# EAGLE design nixie (EAGLE 5.11)
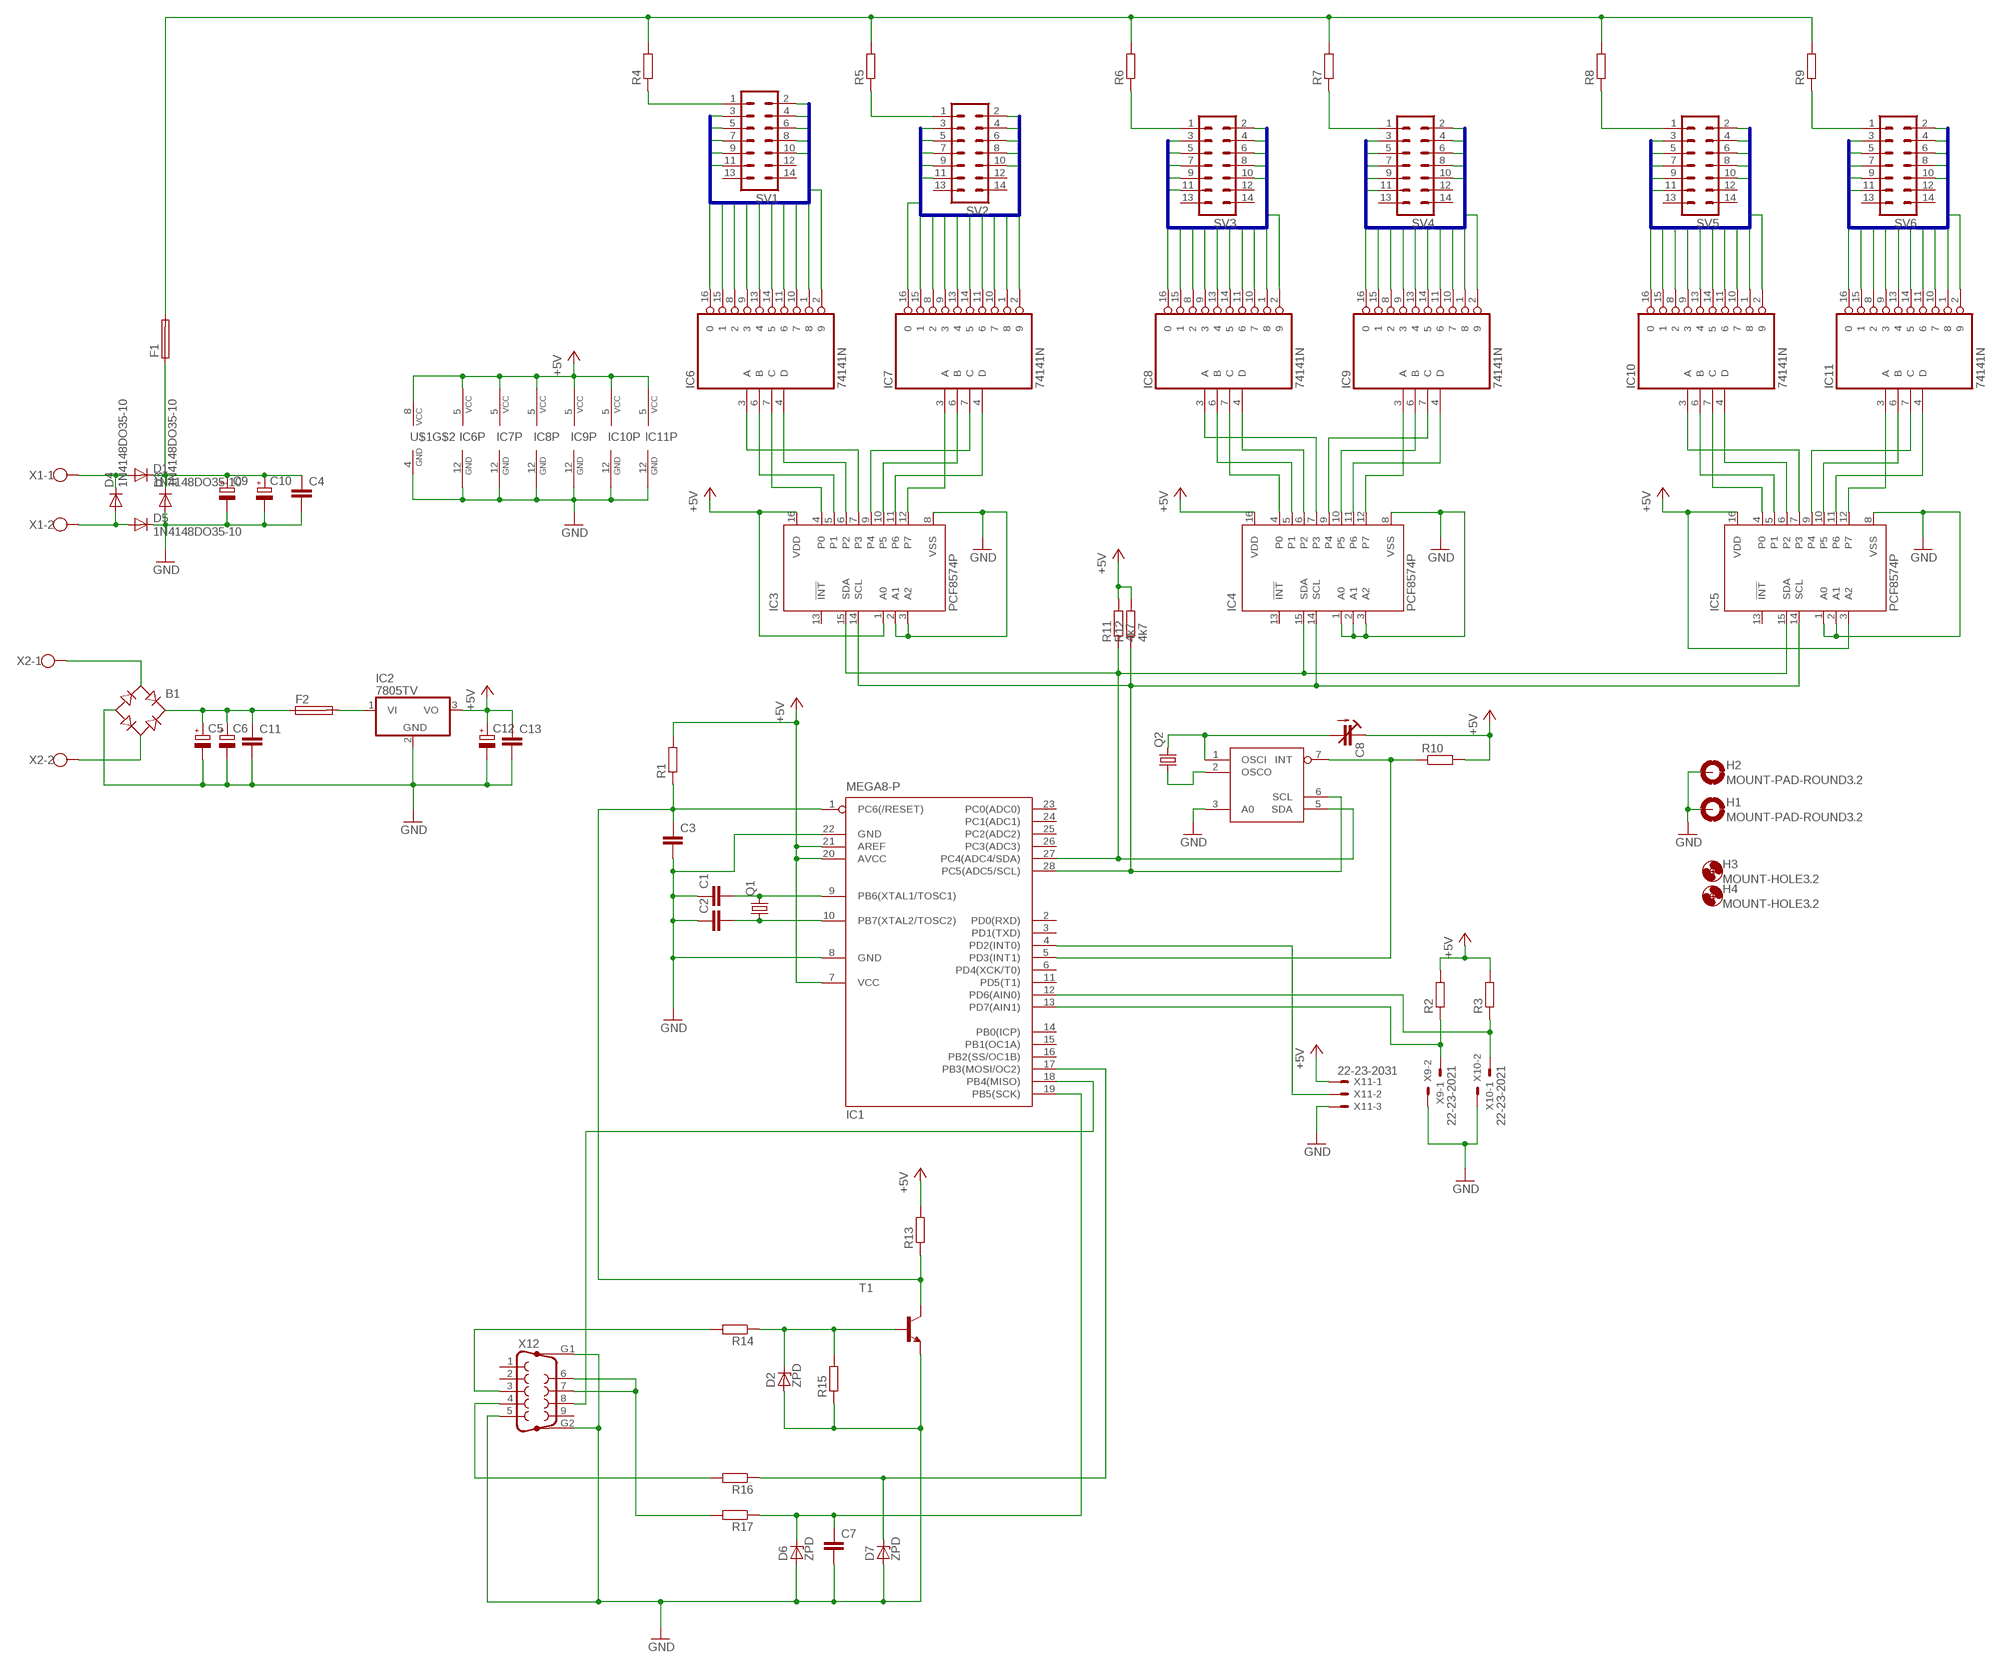
[diagram p0: schematic, sheet 1]

## Parts
B1  RB1A  [RB1A]
C1  C-EU025-025X050  [C025-025X050]
C2  C-EU025-025X050  [C025-025X050]
C3  C-EU025-025X050  [C025-025X050]
C4  C-EU150-054X183  [C150-054X183]
C5  CPOL-EUE5-10.5  [E5-10,5]
C6  CPOL-EUE5-10.5  [E5-10,5]
C7  C-EU050-024X044  [C050-024X044]
C8  C-TRIMM808  [CTRIM808-BC]
C9  CPOL-EUE7.5-18  [E7,5-18]
C10  CPOL-EUE7.5-18  [E7,5-18]
C11  C-EU050-025X075  [C050-025X075]
C12  CPOL-EUE2.5-7  [E2,5-7]
C13  C-EU050-025X075  [C050-025X075]
D1  1N4148DO35-10  [DO35-10]
D2  ZPD  [DO35Z10]
D3  1N4148DO35-10  [DO35-10]
D4  1N4148DO35-10  [DO35-10]
D5  1N4148DO35-10  [DO35-10]
D6  ZPD  [DO35Z10]
D7  ZPD  [DO35Z10]
F1  SH25  [SH25]
F2  SH25  [SH25]
H1  MOUNT-PAD-ROUND3.2  [3,2-PAD]
H2  MOUNT-PAD-ROUND3.2  [3,2-PAD]
H3  MOUNT-HOLE3.2  [3,2]
H4  MOUNT-HOLE3.2  [3,2]
IC1  MEGA8-P  [DIL28-3]
IC2  7805TV  [TO220V]
IC3  PCF8574P  [DIL16]
IC4  PCF8574P  [DIL16]
IC5  PCF8574P  [DIL16]
IC6  74141N  [DIL16]
IC7  74141N  [DIL16]
IC8  74141N  [DIL16]
IC9  74141N  [DIL16]
IC10  74141N  [DIL16]
IC11  74141N  [DIL16]
Q1  CRYSTALHC49S  [HC49/S]
Q2  CRYSTALTC26V  [TC26V]
R1  R-EU_0207/10  [0207/10]
R2  R-EU_0207/10  [0207/10]
R3  R-EU_0207/10  [0207/10]
R4  R-EU_0207/10  [0207/10]
R5  R-EU_0207/10  [0207/10]
R6  R-EU_0207/10  [0207/10]
R7  R-EU_0207/10  [0207/10]
R8  R-EU_0207/10  [0207/10]
R9  R-EU_0207/10  [0207/10]
R10  R-EU_0207/10  [0207/10]
R11  4k7  R-EU_0207/10  [0207/10]
R12  4k7  R-EU_0207/10  [0207/10]
R13  R-EU_0207/10  [0207/10]
R14  R-EU_0207/10  [0207/10]
R15  R-EU_0207/10  [0207/10]
R16  R-EU_0207/10  [0207/10]
R17  R-EU_0207/10  [0207/10]
SV1  ML14  [ML14]
SV2  ML14  [ML14]
SV3  ML14  [ML14]
SV4  ML14  [ML14]
SV5  ML14  [ML14]
SV6  ML14  [ML14]
T1  BC547B-NPN-TO92-CBE  [TO92-CBE]
U$1  PCF8583P  [DIL08]
X1  W237-102  [W237-102]
X2  W237-102  [W237-102]
X9  22-23-2021  [22-23-2021]
X10  22-23-2021  [22-23-2021]
X11  22-23-2031  [22-23-2031]
X12  F09HP  [F09HP]

## Nets
+5V: C8.1(E) C12.+ C13.1 IC1.7(VCC) IC1.20(AVCC) IC1.21(AREF) IC2.3(VO) IC3.1(A0) IC3.16(VDD) IC4.16(VDD) IC5.3(A2) IC5.16(VDD) IC6.5(VCC) IC7.5(VCC) IC8.5(VCC) IC9.5(VCC) IC10.5(VCC) IC11.5(VCC) R1.2 R2.2 R3.2 R10.2 R11.2 R12.2 R13.2 U$1.8(VCC) X11.1
GND: B1.- C1.1 C2.1 C3.2 C4.2 C5.- C6.- C7.2 C9.- C10.- C11.2 C12.- C13.2 D2.A D3.A D5.C D6.A D7.A H1.B3,2(MOUNT) H2.B3,2(MOUNT) IC1.8(GND) IC1.22(GND) IC2.2(GND) IC3.2(A1) IC3.3(A2) IC3.8(VSS) IC4.1(A0) IC4.2(A1) IC4.3(A2) IC4.8(VSS) IC5.1(A0) IC5.2(A1) IC5.8(VSS) IC6.12(GND) IC7.12(GND) IC8.12(GND) IC9.12(GND) IC10.12(GND) IC11.12(GND) R15.1 T1.E U$1.3(A0) U$1.4(GND) X9.2 X10.2 X11.3 X12.5 X12.G1 X12.G2
N1_0: IC6.16 SV1.4
N1_1: IC6.15 SV1.5
N1_2: IC6.8 SV1.11
N1_3: IC6.9 SV1.10
N1_4: IC6.13 SV1.7
N1_5: IC6.14 SV1.6
N1_6: IC6.11 SV1.8
N1_7: IC6.10 SV1.9
N1_8: IC6.1 SV1.2
N1_9: IC6.2 SV1.3
N2_0: IC7.16 SV2.4
N2_1: IC7.15 SV2.5
N2_2: IC7.8 SV2.11
N2_3: IC7.9 SV2.10
N2_4: IC7.13 SV2.7
N2_5: IC7.14 SV2.6
N2_6: IC7.11 SV2.8
N2_7: IC7.10 SV2.9
N2_8: IC7.1 SV2.2
N2_9: IC7.2 SV2.3
N3_0: IC8.16 SV3.4
N3_1: IC8.15 SV3.5
N3_2: IC8.8 SV3.11
N3_3: IC8.9 SV3.10
N3_4: IC8.13 SV3.7
N3_5: IC8.14 SV3.6
N3_6: IC8.11 SV3.8
N3_7: IC8.10 SV3.9
N3_8: IC8.1 SV3.2
N3_9: IC8.2 SV3.3
N4_0: IC9.16 SV4.4
N4_1: IC9.15 SV4.5
N4_2: IC9.8 SV4.11
N4_3: IC9.9 SV4.10
N4_4: IC9.13 SV4.7
N4_5: IC9.14 SV4.6
N4_6: IC9.11 SV4.8
N4_7: IC9.10 SV4.9
N4_8: IC9.1 SV4.2
N4_9: IC9.2 SV4.3
N5_0: IC10.16 SV5.4
N5_1: IC10.15 SV5.5
N5_2: IC10.8 SV5.11
N5_3: IC10.9 SV5.10
N5_4: IC10.13 SV5.7
N5_5: IC10.14 SV5.6
N5_6: IC10.11 SV5.8
N5_7: IC10.10 SV5.9
N5_8: IC10.1 SV5.2
N5_9: IC10.2 SV5.3
N6_0: IC11.16 SV6.4
N6_1: IC11.15 SV6.5
N6_2: IC11.8 SV6.11
N6_3: IC11.9 SV6.10
N6_4: IC11.13 SV6.7
N6_5: IC11.14 SV6.6
N6_6: IC11.11 SV6.8
N6_7: IC11.10 SV6.9
N6_8: IC11.1 SV6.2
N6_9: IC11.2 SV6.3
N$1: C1.2 IC1.9(PB6(XTAL1/TOSC1)) Q1.2
N$2: C2.2 IC1.10(PB7(XTAL2/TOSC2)) Q1.1
N$3: IC3.9(P4) IC7.7(C)
N$4: IC3.10(P5) IC7.6(B)
N$5: IC3.11(P6) IC7.4(D)
N$6: IC3.12(P7) IC7.3(A)
N$7: IC3.4(P0) IC6.7(C)
N$8: IC3.5(P1) IC6.6(B)
N$9: IC3.6(P2) IC6.4(D)
N$10: IC3.7(P3) IC6.3(A)
N$11: IC4.4(P0) IC8.7(C)
N$12: IC4.5(P1) IC8.6(B)
N$13: IC4.6(P2) IC8.4(D)
N$14: IC4.7(P3) IC8.3(A)
N$15: IC4.9(P4) IC9.7(C)
N$16: IC4.10(P5) IC9.6(B)
N$17: R6.1 SV3.1
N$18: IC5.10(P5) IC11.6(B)
N$19: IC5.4(P0) IC10.7(C)
N$20: IC5.5(P1) IC10.6(B)
N$21: IC5.6(P2) IC10.4(D)
N$22: IC5.7(P3) IC10.3(A)
N$23: IC5.9(P4) IC11.7(C)
N$24: R4.1 SV1.1
N$25: R5.1 SV2.1
N$26: R7.1 SV4.1
N$27: IC1.27(PC4(ADC4/SDA)) IC3.15(SDA) IC4.15(SDA) IC5.15(SDA) R11.1 U$1.5(SDA)
N$28: IC1.28(PC5(ADC5/SCL)) IC3.14(SCL) IC4.14(SCL) IC5.14(SCL) R12.1 U$1.6(SCL)
N$29: R8.1 SV5.1
N$30: IC1.13(PD7(AIN1)) R2.1 X9.1
N$31: IC1.12(PD6(AIN0)) R3.1 X10.1
N$32: F1.2 R4.2 R5.2 R6.2 R7.2 R8.2 R9.2
N$33: B1.AC1 X2.1
N$34: D4.A D5.A X1.2
N$35: D1.A D4.C X1.1
N$36: B1.AC2 X2.2
N$37: R9.1 SV6.1
N$38: B1.+ C5.+ C6.+ C11.1 F2.1
N$39: C4.1 C9.+ C10.+ D1.C D3.C F1.1
N$40: F2.2 IC2.1(VI)
N$64: IC5.11(P6) IC11.4(D)
N$65: IC5.12(P7) IC11.3(A)
N$66: IC4.11(P6) IC9.4(D)
N$67: IC4.12(P7) IC9.3(A)
N$104: IC1.5(PD3(INT1)) R10.1 U$1.7(INT)
N$105: IC1.4(PD2(INT0)) X11.2
N$106: C3.1 IC1.1(PC6(/RESET)) R1.1 R13.1 T1.C
N$107: Q2.1 U$1.2(OSCO)
N$108: C8.2(A) Q2.2 U$1.1(OSCI)
N$110: D2.C R14.1 R15.2 T1.B
N$112: R14.2 X12.3
N$113: IC1.18(PB4(MISO)) X12.8
N$114: R16.2 X12.4
N$115: D7.C IC1.17(PB3(MOSI/OC2)) R16.1
N$116: R17.2 X12.6 X12.7
N$117: C7.1 D6.C IC1.19(PB5(SCK)) R17.1
Unconnected: IC1.2(PD0(RXD)) IC1.3(PD1(TXD)) IC1.6(PD4(XCK/T0)) IC1.11(PD5(T1)) IC1.14(PB0(ICP)) IC1.15(PB1(OC1A)) IC1.16(PB2(SS/OC1B)) IC1.23(PC0(ADC0)) IC1.24(PC1(ADC1)) IC1.25(PC2(ADC2)) IC1.26(PC3(ADC3)) IC3.13(!INT) IC4.13(!INT) IC5.13(!INT) SV1.12 SV1.13 SV1.14 SV2.12 SV2.13 SV2.14 SV3.12 SV3.13 SV3.14 SV4.12 SV4.13 SV4.14 SV5.12 SV5.13 SV5.14 SV6.12 SV6.13 SV6.14 X12.1 X12.2 X12.9

## Buses
B$1
B$2
B$3
B$4
B$5
B$6

## Library data of the parts
B1 = rectifier:RB1A: RECTIFIER 1 A
C1-C4 C7 C11 C13 = rcl:C-EU: CAPACITOR, European symbol
C5 C6 C9 C10 C12 = rcl:CPOL-EU: POLARIZED CAPACITOR, European symbol
C8 = rcl:C-TRIMM: Trimm capacitor
D1 D3-D5 = diode:1N4148: DIODE high speed (Philips)
D2 D6 D7 = diode:ZPD: Z DIODE 500 mW
F1 F2 = fuse:SH25: FUSE HOLDER grid 25 mm, OGN0031 8211, Schurter (Buerklin); MF: SCHURTER; MPN: 0031.8211; OC_FARNELL: 1162741; OC_NEWARK: 96B9380
H1 H2 = holes:MOUNT-PAD-ROUND: MOUNTING PAD, round
H3 H4 = holes:MOUNT-HOLE: MOUNTING HOLE with drill center marker
IC1 = atmel:MEGA8-P: MICROCONTROLLER 8 Kbytes FLASH, 1 kbytes SRAM, 512 bytes EEPROM, USART, 4-channel 10 bit ADC, 2-channel 8 bit ADC Pin compatible with Atmega48, ATMega88, ATMega168 Source: avr.lbr
IC2 = linear:78*: Positive VOLTAGE REGULATOR Source: http://cache.national.com/ds/LM/LM78L05.pdf http://www.fairchildsemi.com/ds/LM/LM7805.pdf
IC3-IC5 = micro-philips:PCF8574: I2C-Bus Remote 8-bit I/O expander http://www.semiconductors.philips.com/acrobat_download/datasheets/PCF8574_4.pdf
IC6-IC11 = 74xx-us:74*141: BCD to decimal DECODER/DRIVER
Q1 = crystal:CRYSTAL: CRYSTAL; OC_FARNELL: 1667008; OC_NEWARK: unknown
Q2 = crystal:CRYSTAL: CRYSTAL; OC_FARNELL: unknown; OC_NEWARK: unknown
R1-R17 = rcl:R-EU_: RESISTOR, European symbol
SV1-SV6 = con-harting-ml:ML14: HARTING; OC_FARNELL: unknown; OC_NEWARK: unknown
T1 = transistor:*-NPN-: NPN Transistror BF959 corrected 2008.03.06
U$1 = i2c:PCF8583: Clock/calendar with 240 x 8-bit RAM
X1 X2 = con-wago-500:W237-102: WAGO SCREW CLAMP
X9 X10 = con-molex:22-23-2021: .100" (2.54mm) Center Header - 2 Pin
X11 = con-molex:22-23-2031: .100" (2.54mm) Center Header - 3 Pin
X12 = con-subd:F09HP: SUB-D; OC_FARNELL: unknown; OC_NEWARK: unknown

## Board
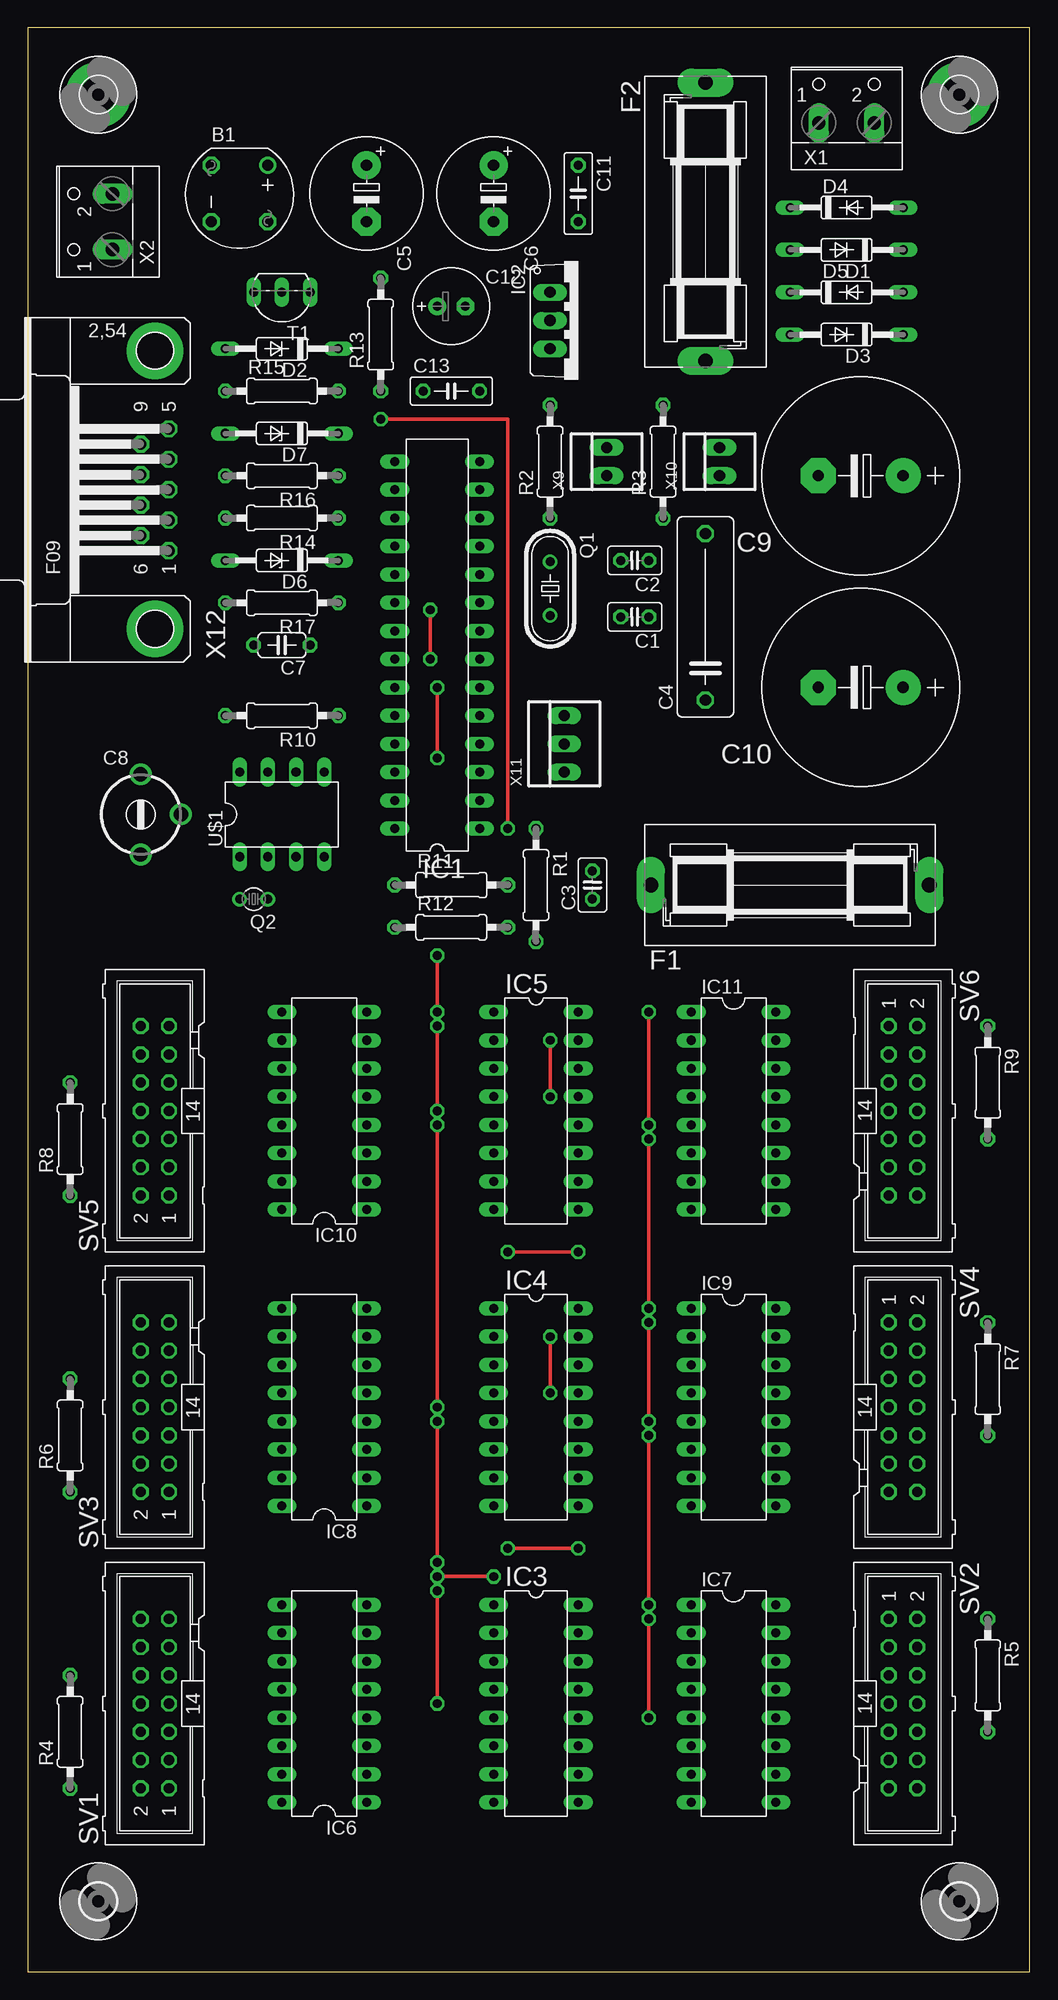
[diagram p1: board, top side]
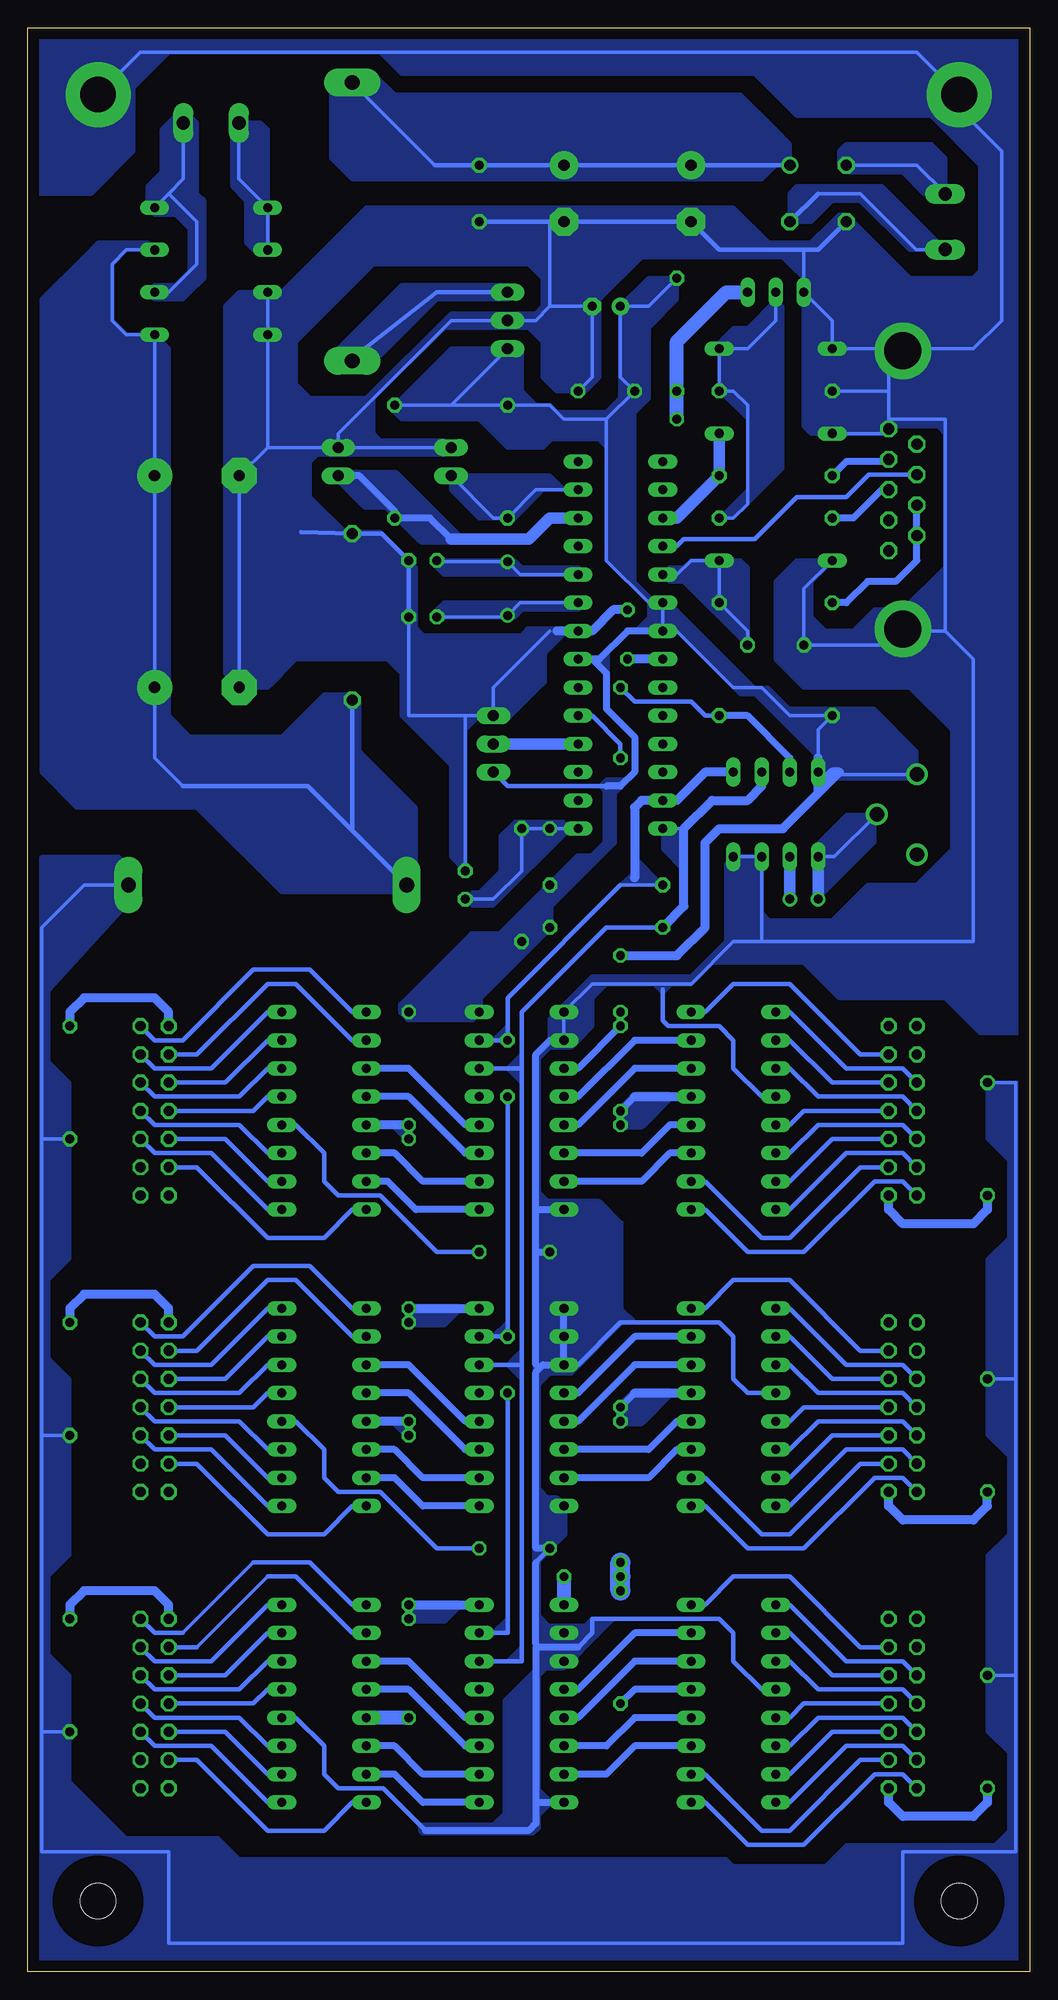
[diagram p2: board, bottom side, seen from below]

Size 90.15 x 174.93 mm. Coordinates in mm from the lower left corner, seen from the top.
Outline: 0,0 90.15,0 90.15,174.93 0,174.93 0,0
Copper layers (1*16): Top 0.035mm / dielectric 1.5mm / Bottom 0.035mm
Design rules "default": minimum track width 10mil, minimum drill 24mil, track to track 8mil, track to pad 8mil, pad to pad 8mil, via to via 8mil, smd to smd 8mil, copper to edge 40mil, drill to drill 8mil, minimum pad ring 10mil, minimum via ring 8mil, stop-mask expansion 4mil, vias tented up to drill 0mil, thermal gap 10mil

### Footprints (pad centres in the part's own frame; a part is rotated, then mirrored left to right if it is on the bottom)
RB1A = drill 1.016 round: + -2.54,2.54 | drill 1.016 octagon: - 2.54,-2.54; AC1 2.54,2.54; AC2 -2.54,-2.54
C025-025X050 = drill 0.813 octagon: 1 -1.27,0; 2 1.27,0
C150-054X183 = drill 1.016 octagon: 1 -7.493,0; 2 7.493,0
E5-10,5 = drill 1.016 pad 2.54 round: + -2.54,0 | drill 1.016 pad 2.54 octagon: - 2.54,0
C050-024X044 = drill 0.813 octagon: 1 -2.54,0; 2 2.54,0
CTRIM808-BC = drill 1.3 round: 1 -3.607,0; 2 0,3.607; 3 3.607,0
E7,5-18 = drill 1.016 pad 3.15 round: + -3.81,0 | drill 1.016 pad 3.15 octagon: - 3.81,0
C050-025X075 = drill 0.813 octagon: 1 -2.54,0; 2 2.54,0
E2,5-7 = drill 0.813 pad 1.6 round: + -1.27,0 | drill 0.813 pad 1.6 octagon: - 1.27,0
DO35-10 = drill 0.813 long: A 5.08,0; C -5.08,0
DO35Z10 = drill 0.813 long: A 5.08,0; C -5.08,0
SH25 = drill 1.321 pad 2.54 long: 1 -12.522,0; 2 12.522,0
3,2-PAD = drill 3.2 pad 5.842 round: B3,2 0,0
3,2 = hole 3.2: 0,0
DIL28-3 = drill 0.813 long: 1 -16.51,-3.81; 2 -13.97,-3.81; 3 -11.43,-3.81; 4 -8.89,-3.81; 5 -6.35,-3.81; 6 -3.81,-3.81; 7 -1.27,-3.81; 8 1.27,-3.81; 9 3.81,-3.81; 10 6.35,-3.81; 11 8.89,-3.81; 12 11.43,-3.81; 13 13.97,-3.81; 14 16.51,-3.81; 15 16.51,3.81; 16 13.97,3.81; 17 11.43,3.81; 18 8.89,3.81; 19 6.35,3.81; 20 3.81,3.81; 21 1.27,3.81; 22 -1.27,3.81; 23 -3.81,3.81; 24 -6.35,3.81; 25 -8.89,3.81; 26 -11.43,3.81; 27 -13.97,3.81; 28 -16.51,3.81
TO220V = drill 1.016 long: 1 -2.54,-2.54; 2 0,-2.54; 3 2.54,-2.54
DIL16 = drill 0.813 long: 1 -8.89,-3.81; 2 -6.35,-3.81; 3 -3.81,-3.81; 4 -1.27,-3.81; 5 1.27,-3.81; 6 3.81,-3.81; 7 6.35,-3.81; 8 8.89,-3.81; 9 8.89,3.81; 10 6.35,3.81; 11 3.81,3.81; 12 1.27,3.81; 13 -1.27,3.81; 14 -3.81,3.81; 15 -6.35,3.81; 16 -8.89,3.81
HC49/S = drill 0.813 round: 1 -2.413,0; 2 2.413,0
TC26V = drill 0.813 round: 1 -1.27,0; 2 1.27,0
0207/10 = drill 0.813 octagon: 1 -5.08,0; 2 5.08,0
ML14 = drill 0.914 octagon: 1 -7.62,-1.27; 2 -7.62,1.27; 3 -5.08,-1.27; 4 -5.08,1.27; 5 -2.54,-1.27; 6 -2.54,1.27; 7 0,-1.27; 8 0,1.27; 9 2.54,-1.27; 10 2.54,1.27; 11 5.08,-1.27; 12 5.08,1.27; 13 7.62,-1.27; 14 7.62,1.27
TO92-CBE = drill 0.813 long: B 0,0; C -2.54,0; E 2.54,0
DIL08 = drill 0.813 long: 1 -3.81,-3.81; 2 -1.27,-3.81; 3 1.27,-3.81; 4 3.81,-3.81; 5 3.81,3.81; 6 1.27,3.81; 7 -1.27,3.81; 8 -3.81,3.81
W237-102 = drill 1.194 long: 1 -2.5,-1.27; 2 2.5,-1.27
22-23-2021 = drill 1 long: 1 -1.27,0; 2 1.27,0
22-23-2031 = drill 1 long: 1 -2.54,0; 2 0,0; 3 2.54,0
F09HP = drill 1.016 octagon: 1 -5.486,-1.27; 2 -2.743,-1.27; 3 0,-1.27; 4 2.743,-1.27; 5 5.486,-1.27; 6 -4.115,1.27; 7 -1.372,1.27; 8 1.372,1.27; 9 4.115,1.27 | drill 3.302 pad 5.08 round: G1 -12.522,0; G2 12.522,0

### Placement (x,y rotation side)
B1  19.05,160.02 270 top
C1  54.61,121.92 180 top
C2  54.61,127 180 top
C3  50.8,97.79 90 top
C4  60.96,121.92 90 top
C5  30.48,160.02 270 top
C6  41.91,160.02 270 top
C7  22.86,119.38 180 top
C8  10.16,104.14 270 top
C9  74.93,134.62 180 top
C10  74.93,115.57 180 top
C11  49.53,160.02 270 top
C12  38.1,149.86 0 top
C13  38.1,142.24 0 top
D1  73.66,154.94 180 top
D2  22.86,146.05 180 top
D3  73.66,147.32 180 top
D4  73.66,158.75 0 top
D5  73.66,151.13 0 top
D6  22.86,127 180 top
D7  22.86,138.43 180 top
F1  68.58,97.79 0 top
F2  60.96,157.48 270 top
H1  83.82,168.91 0 top
H2  6.35,168.91 0 top
H3  83.82,6.35 0 top
H4  6.35,6.35 0 top
IC1  36.83,119.38 90 top
IC2  49.53,148.59 270 top
IC3  45.72,24.13 270 top
IC4  45.72,50.8 270 top
IC5  45.72,77.47 270 top
IC6  26.67,24.13 90 top
IC7  63.5,24.13 270 top
IC8  26.67,50.8 90 top
IC9  63.5,50.8 270 top
IC10  26.67,77.47 90 top
IC11  63.5,77.47 270 top
Q1  46.99,124.46 270 top
Q2  20.32,96.52 180 top
R1  45.72,97.79 270 top
R2  46.99,135.89 90 top
R3  57.15,135.89 90 top
R4  3.81,21.59 90 top
R5  86.36,26.67 270 top
R6  3.81,48.26 90 top
R7  86.36,53.34 270 top
R8  3.81,74.93 90 top
R9  86.36,80.01 270 top
R10  22.86,113.03 180 top
R11  38.1,97.79 0 top
R12  38.1,93.98 0 top
R13  31.75,147.32 90 top
R14  22.86,130.81 180 top
R15  22.86,142.24 0 top
R16  22.86,134.62 180 top
R17  22.86,123.19 180 top
SV1  11.43,24.13 90 top
SV2  78.74,24.13 270 top
SV3  11.43,50.8 90 top
SV4  78.74,50.8 270 top
SV5  11.43,77.47 90 top
SV6  78.74,77.47 270 top
T1  22.86,151.13 180 top
U$1  22.86,104.14 0 top
X1  73.66,167.64 0 top
X2  6.35,157.48 90 top
X9  52.07,135.89 90 top
X10  62.23,135.89 90 top
X11  48.26,110.49 90 top
X12  11.43,133.35 90 top

### Tracks (layer width: path | path; a pad name or v marks a point on that pad's centre or on a via)
+5V  (via drill 0.8 pad 1.27)
  Top 0.305: v55.88,76.2 v55.88,86.36 | v55.88,22.86 v55.88,31.75 | v55.88,59.69 v55.88,74.93 | v55.88,49.53 v55.88,58.42 | v55.88,33.02 v55.88,48.26 | v36.83,50.8 v36.83,76.2 | v36.83,24.13 v36.83,34.29 | v36.83,36.83 v36.83,49.53 | v36.83,35.56 v41.91,35.56 | v36.83,77.47 v36.83,85.09 | v36.83,86.36 v36.83,91.44
  Bottom 0.305: 52.07,140.97 R3.2 | 52.07,140.97 IC2.3 | 18.85,107.75 U$1.8 19.05,109.22 19.05,111.76 R10.2 21.59,113.03 24.13,115.57 26.67,115.57 31.75,120.65 IC1.21 IC1.20 34.29,123.19 38.1,127 38.1,139.7 | 38.1,139.7 41.91,139.7 43.18,140.97 R2.2 52.07,140.97 | 38.1,139.7 C13.1 36.83,143.51 C12.+ 34.29,149.86 R13.2 | 18.85,106.88 18.85,107.75 | 18.85,107.75 C8.1
  Bottom 0.406: X11.1 46.99,106.68 38.1,106.68
  Bottom 0.61: v55.88,31.75 v55.88,33.02 | v55.88,48.26 v55.88,49.53 | IC6.5 35.56,25.4 v36.83,24.13 | IC1.21 36.2,120.65 38.73,118.11 IC1.7 39.37,118.11 38.1,116.84 38.1,113.67 35.56,111.12 35.56,107.95 36.83,106.68 38.1,106.68 | v36.83,86.36 v36.83,85.09 40.64,81.28 IC5.3 | 35.56,78.74 v36.83,77.47 v36.83,76.2 | v55.88,74.93 v55.88,76.2 | v36.83,49.53 v36.83,50.8 35.56,52.07 | v55.88,58.42 v55.88,59.69
  Bottom 0.813: v55.88,49.53 IC9.5 | v55.88,33.02 IC3.16 | 18.85,106.25 18.85,106.88 | 19.05,106.05 22.23,102.87 27.94,102.87 29.21,101.6 29.21,93.98 31.75,91.44 v36.83,91.44 | 19.05,106.05 18.85,106.25 | 19.05,106.05 19.05,109.22 | 18.85,106.25 17.14,107.95 17.78,107.95 18.41,107.31 | 35.56,78.74 IC10.5 | v55.88,76.2 IC11.5 | 35.56,52.07 IC8.5 | v55.88,59.69 IC4.16
  Bottom 1.27: v55.88,22.86 IC7.5 | v41.91,35.56 IC3.1
  Bottom 1.778: v36.83,34.29 v36.83,35.56 v36.83,36.83
  pour Bottom (no thermals): 45.72,146.05 45.72,142.24 44.45,140.97 44.45,137.16 46.99,137.16 49.53,139.7 56.52,139.7 57.15,140.34 57.15,140.97 52.07,146.05
  pour Bottom (no thermals): 44.45,140.97 43.18,140.97 42.55,140.34 38.1,140.34 36.83,141.6 36.83,149.86 34.29,152.4 31.75,152.4 31.75,150.5 34.29,147.96 34.29,141.6 37.97,137.92 43.05,137.92 43.81,137.16 45.72,137.16 45.09,138.43 45.72,139.06 45.72,139.7
  pour Bottom (no thermals): 35.56,140.34 35.56,125.09 33.66,123.19 33.02,123.19 33.02,120.65 34.29,120.65 34.29,123.19 38.1,127 38.1,137.16 39.12,138.18 37.47,140.34
  pour Bottom (no thermals): 33.66,123.19 32.38,123.19 24.77,115.57 23.5,115.57 21.59,113.67 13.97,113.67 10.16,109.86 10.16,107.31 18.41,107.31 19.05,107.95 19.05,109.22 24.77,114.94 26.04,114.94 31.75,120.65 33.66,120.65
  pour Bottom (no thermals): 43.18,97.79 40.64,100.33 39.37,100.33 38.1,101.6 38.1,106.68 36.83,106.68 37.47,106.05 37.47,101.6 43.18,95.89 43.18,93.98 49.53,87.63 49.53,86.36 50.16,85.72 55.88,85.72 56.52,86.36 56.52,87 50.16,93.34 47.62,93.34
  pour Bottom (no thermals): 38.1,105.41 38.1,106.05 38.73,106.68 38.1,107.31 36.2,107.31
  pour Bottom (no thermals): 35.56,120.65 34.29,121.92 34.29,120.65
  pour Bottom (no thermals): 38.1,118.75 38.1,116.84 39.37,118.11 38.73,118.11
  pour Bottom (no thermals): 55.88,74.93 57.15,76.2 55.88,76.2
  pour Bottom (no thermals): 55.88,58.42 52.7,58.42 51.44,59.69 55.88,59.69
  pour Bottom (no thermals): 55.88,48.26 57.15,49.53 55.88,49.53
  pour Bottom (no thermals): 55.88,31.75 52.7,31.75 51.44,33.02 55.88,33.02
  pour Bottom (no thermals): 36.83,49.53 34.92,49.53 32.38,52.07 35.56,52.07 36.83,50.8
  pour Bottom (no thermals): 36.83,76.2 34.92,76.2 32.38,78.74 35.56,78.74 36.83,77.47
GND  (via drill 0.8 pad 1.27)
  Top 0.305: v36.2,118.11 v36.2,122.56 | v43.18,64.77 v49.53,64.77 | v43.18,38.1 v49.53,38.1
  Bottom 0.305: 12.7,139.7 X12.5 | 12.7,139.7 12.7,142.24 | 12.7,142.24 12.7,144.6 X12.G2 | 12.7,142.24 R15.1 | X12.G2 11.61,146.05 D2.A 17.78,148.59 T1.E 20.32,154.94 | X12.5 13.11,138.43 D7.A 12.7,138.43 X12.5 | D6.A 20.32,124.46 C7.2 12.7,119.38 11.43,120.65 X12.G1 11.25,120.65 7.62,120.65 | 12.7,139.7 7.62,139.7 7.62,120.65 | 43.18,149.86 44.45,148.59 IC2.2 52.07,148.59 62.23,138.43 X10.2 | 43.18,157.48 43.18,149.86 | 50.8,113.03 55.88,113.03 C1.1 | 50.8,113.03 X11.3 48.26,115.57 43.18,120.65 | C3.2 50.8,113.03 | C13.2 39.37,143.51 C12.- 43.18,149.86 | X10.2 X9.2 | 7.62,120.65 5.08,118.11 5.08,92.71 24.13,92.71 | 43.18,83.82 IC5.2 IC5.1 39.37,88.9 30.48,88.9 26.67,92.71 24.13,92.71 | 43.81,54.61 44.45,54.61 | U$1.4 U$1.3 24.13,92.71 | 68.58,137.16 D3.A D5.C | 68.58,137.16 C9.- C10.- | X10.2 68.58,137.16 | X12.G2 11.25,146.05 5.08,146.05 2.54,148.59 2.54,163.83 6.35,167.64 H2.B3,2 10.16,172.72 80.01,172.72 H1.B3,2
  Bottom 0.406: B1.- 19.05,154.94 20.32,154.94 27.94,154.94 C5.- C6.- 43.18,157.48 C11.2 | 65.53,129.54 C4.2 58.29,129.41 C2.1 C1.1 | IC6.12 24.13,25.4 26.67,27.94 26.67,30.48 27.94,31.75 39.37,31.75 39.37,30.48 40.64,29.21 | IC10.12 24.13,78.74 26.67,81.28 26.67,83.82 27.94,85.09 32.51,85.09 33.02,85.6 33.02,88.39 | IC11.12 66.04,76.2 63.5,73.66 63.5,71.12 62.23,69.85 58.42,69.85 53.34,64.77 v49.53,64.77 | IC9.12 66.04,49.53 63.5,46.99 63.5,44.45 62.23,43.18 58.42,43.18 53.34,38.1 v49.53,38.1 | IC7.12 66.04,22.86 63.5,20.32 63.5,17.78 62.23,16.51 58.17,16.51 54.36,12.7 | IC4.3 40.64,54.61 36.83,58.42 27.94,58.42 26.67,57.15 26.67,53.34 25.4,52.07 IC8.12 | 44.45,36.83 v43.18,38.1
  Bottom 0.61: 43.18,83.82 44.45,82.55 44.45,68.58 | 44.45,54.61 44.45,64.77 | 44.45,64.77 44.45,68.58 | v43.18,38.1 44.45,38.1 44.45,53.98 43.81,54.61 IC4.3 IC4.2 IC4.1 | 44.45,15.24 44.45,29.21 44.2,29.21 | 44.45,15.24 IC3.8 | 44.45,15.24 44.45,13.34 45.09,12.7 54.36,12.7 | 40.64,29.21 44.2,29.21 | 44.45,68.58 IC5.8 | 44.45,64.77 v43.18,64.77 | 44.45,36.83 44.45,29.46 44.2,29.21
  Bottom 0.813: IC1.22 v36.2,118.11 | v36.2,122.56 37.47,122.56 39.37,120.65 IC1.8 42.55,120.65
  pour Bottom (no thermals): 16.51,158.12 10.79,152.4 5.08,152.4 4.45,153.03 4.45,162.56 8.89,167 20.95,167 24.13,170.18 24.13,174.62 0,174.62 0,144.15 17.78,144.15 20.32,146.69 20.32,154.94 17.14,158.12
  pour Bottom (no thermals): 19.68,155.57 23.5,155.57 26.67,158.75 48.9,158.75 49.53,158.12 49.53,154.94 48.26,153.67 45.09,153.67 43.81,152.4 43.81,149.86 44.45,149.22 50.8,149.22 50.8,147.96 45.09,147.96 43.81,146.69 43.81,143.51 42.55,142.24 40.01,142.24 38.73,143.51 38.73,150.5 34.92,154.31 22.23,154.31 19.68,151.76
  pour Bottom (no thermals): 20.32,147.32 20.32,139.06 19.68,138.43 12.7,138.43 12.06,139.06 8.26,139.06 7.62,138.43 7.62,124.46 0.64,124.46 0.64,146.69 2.54,148.59 19.05,148.59
  pour Bottom (no thermals): 7.62,127.64 7.62,126.36 11.43,122.56 13.97,122.56 15.88,120.65 18.41,120.65 19.68,121.92 19.68,125.09 17.78,127 20.95,127 22.86,125.09 22.86,118.11 20.32,115.57 10.79,115.57 6.99,111.76 6.99,92.71 0.64,92.71 0.64,127.64
  pour Bottom (no thermals): 0.64,93.34 0.64,84.45 4.45,84.45 7.62,87.63 17.14,87.63 20.32,90.81 28.57,90.81 30.48,88.9 38.1,88.9 39.37,87.63 39.37,85.09 40.64,83.82 43.18,83.82 43.18,85.72 39.37,89.53 30.48,89.53 27.3,92.71 27.3,99.69 26.67,100.33 24.13,100.33 24.13,95.25 23.5,94.61 17.78,94.61 14.61,97.79 10.16,97.79 6.99,100.97 5.08,100.97 0.64,96.52
  pour Bottom (no thermals): 23.5,169.54 24.77,170.81 56.52,170.81 58.42,172.72 77.47,172.72 80.64,169.54 80.64,163.83 84.45,160.02 90.17,160.02 90.17,174.62 23.5,174.62
  pour Bottom (no thermals): 71.12,115.57 68.58,115.57 66.04,118.11 57.78,118.11 56.52,116.84 56.52,113.03 52.07,108.58 52.07,100.33 50.8,99.06 50.8,111.76 49.53,113.03 46.99,113.03 46.35,113.67 46.35,114.94 50.16,118.75 53.98,118.75 55.24,120.02 55.24,126.36 58.42,129.54 61.59,129.54 64.77,132.72 64.77,141.6 67.31,144.15 67.31,150.5 67.94,151.13 71.12,151.13 72.39,149.86 72.39,116.84
  pour Bottom (no thermals): 48.26,158.75 59.69,158.75 67.94,150.5 67.94,143.51 66.04,142.88 66.04,146.69 59.05,153.67 48.26,153.67
  pour Bottom (no thermals): 50.8,149.22 52.07,149.22 59.69,141.6 65.41,141.6 68.58,135.25 65.41,135.25 64.14,136.53 52.7,136.53 52.07,137.16 52.7,137.79 58.42,137.79 59.05,138.43 59.05,141.6 52.7,147.96 50.8,147.96
  pour Bottom (no thermals): 46.99,113.03 43.81,116.2 43.81,118.75 41.91,120.65 45.09,120.65 45.72,120.02 54.61,120.02 55.24,120.65 55.88,120.65 56.52,120.02 56.52,118.75 50.8,113.03
  pour Bottom: 44.45,54.61 44.45,53.98 43.81,54.61
  pour Bottom (no thermals): 44.45,42.55 43.81,41.91 41.91,41.91 41.91,39.37 44.45,36.83
  pour Bottom (no thermals): 44.45,31.11 43.81,30.48 40.64,30.48 39.37,31.75 39.37,29.84 41.27,27.94 44.45,27.94 44.45,30.48
  pour Bottom (no thermals): 44.45,16.51 43.18,15.24 44.45,13.97
  pour Bottom (no thermals): 44.45,27.3 43.81,27.94 44.45,27.94
  pour Bottom (no thermals): 32.38,88.9 33.02,88.27 33.66,88.9
  pour Bottom (no thermals): 39.37,29.84 37.47,31.75 39.37,31.75
  pour Bottom (no thermals): 40.64,83.82 41.27,83.19 43.18,83.19 44.45,81.92 44.45,82.55 43.18,83.82
  pour Bottom (no thermals): 41.91,41.91 42.55,42.55 43.81,42.55 44.45,43.18 44.45,41.27 42.55,41.27
  pour Bottom (no thermals): 40.01,31.11 43.81,31.11 44.45,31.75 44.45,29.84 41.27,29.84
  pour Bottom (no thermals): 41.27,27.94 41.91,27.3 43.81,27.3 44.45,26.67 44.45,28.57 41.91,28.57
  pour Bottom (no thermals): 41.91,69.22 43.81,69.22 44.45,69.85 44.45,53.98 44.45,53.34 43.81,53.98 41.27,53.98 36.83,58.42 36.83,67.31 38.73,69.22
  pour Bottom: 36.83,59.69 35.56,58.42 36.83,58.42
  pour Bottom: 44.2,82.55 44.2,70.1 42.67,68.58 44.45,68.58 44.45,82.55
  pour Bottom: 43.69,54.36 43.18,53.85 44.2,52.83 44.2,43.43 43.18,42.42 44.45,42.42 44.45,54.36
  pour Bottom: 44.2,37.08 44.2,32 43.18,30.99 44.45,30.99 44.45,37.08
  pour Bottom: 43.69,27.18 44.2,26.67 44.2,12.95 44.7,12.45 54.61,12.45 54.86,12.7 54.86,13.21 48.26,13.21 47.24,14.22 47.24,24.38 44.45,27.18
N1_0
  Bottom 0.406: IC6.16 21.59,15.24 16.51,20.32 11.43,20.32 SV1.4
N1_1
  Bottom 0.406: SV1.5 17.78,21.59 21.59,17.78 IC6.15
N1_2
  Bottom 0.406: IC6.8 29.21,33.02 26.67,35.56 21.59,35.56 15.24,29.21 SV1.11
N1_3
  Bottom 0.406: IC6.9 21.59,33.02 16.51,27.94 11.43,27.94 SV1.10
N1_4
  Bottom 0.406: IC6.13 21.59,22.86 20.32,24.13 SV1.7
N1_5
  Bottom 0.406: IC6.14 21.59,20.32 19.05,22.86 11.43,22.86 SV1.6
N1_6
  Bottom 0.406: IC6.11 21.59,27.94 19.05,25.4 11.43,25.4 SV1.8
N1_7
  Bottom 0.406: IC6.10 21.59,30.48 17.78,26.67 SV1.9
N1_8
  Bottom 0.406: IC6.1 29.21,15.24 25.4,11.43 20.32,11.43 13.97,17.78 11.43,17.78 SV1.2
N1_9
  Bottom 0.406: IC6.2 29.21,17.78 24.13,12.7 21.59,12.7 15.24,19.05 SV1.3
N2_0
  Bottom 0.406: IC7.16 68.58,33.02 73.66,27.94 78.74,27.94 SV2.4
N2_1
  Bottom 0.406: IC7.15 68.58,30.48 72.39,26.67 SV2.5
N2_2
  Bottom 0.406: IC7.8 60.96,15.24 63.5,12.7 68.58,12.7 74.93,19.05 SV2.11
N2_3
  Bottom 0.406: IC7.9 68.58,15.24 73.66,20.32 78.74,20.32 SV2.10
N2_4
  Bottom 0.406: IC7.13 68.58,25.4 69.85,24.13 SV2.7
N2_5
  Bottom 0.406: IC7.14 68.58,27.94 71.12,25.4 78.74,25.4 SV2.6
N2_6
  Bottom 0.406: IC7.11 68.58,20.32 71.12,22.86 78.74,22.86 SV2.8
N2_7
  Bottom 0.406: IC7.10 68.58,17.78 72.39,21.59 SV2.9
N2_8
  Bottom 0.305: 69.85,36.83 76.2,30.48
  Bottom 0.406: IC7.1 60.96,33.02 64.77,36.83 69.85,36.83 | 76.2,30.48 78.74,30.48 SV2.2
N2_9
  Bottom 0.305: 68.58,35.56 74.93,29.21
  Bottom 0.406: IC7.2 60.96,30.48 66.04,35.56 68.58,35.56 | 74.93,29.21 SV2.3
N3_0
  Bottom 0.406: IC8.16 21.59,41.91 16.51,46.99 11.43,46.99 SV3.4
N3_1
  Bottom 0.406: IC8.15 21.59,44.45 17.78,48.26 SV3.5
N3_2
  Bottom 0.406: IC8.8 29.21,59.69 26.67,62.23 21.59,62.23 15.24,55.88 SV3.11
N3_3
  Bottom 0.406: IC8.9 21.59,59.69 16.51,54.61 11.43,54.61 SV3.10
N3_4
  Bottom 0.406: IC8.13 21.59,49.53 20.32,50.8 SV3.7
N3_5
  Bottom 0.406: IC8.14 21.59,46.99 19.05,49.53 11.43,49.53 SV3.6
N3_6
  Bottom 0.406: IC8.11 21.59,54.61 19.05,52.07 11.43,52.07 SV3.8
N3_7
  Bottom 0.406: IC8.10 21.59,57.15 17.78,53.34 SV3.9
N3_8
  Bottom 0.406: IC8.1 29.21,41.91 25.4,38.1 20.32,38.1 13.97,44.45 11.43,44.45 SV3.2
N3_9
  Bottom 0.406: IC8.2 29.21,44.45 24.13,39.37 21.59,39.37 15.24,45.72 SV3.3
N4_0
  Bottom 0.406: IC9.16 68.58,59.69 73.66,54.61 78.74,54.61 SV4.4
N4_1
  Bottom 0.406: IC9.15 68.58,57.15 72.39,53.34 SV4.5
N4_2
  Bottom 0.406: IC9.8 60.96,41.91 63.5,39.37 68.58,39.37 74.93,45.72 SV4.11
N4_3
  Bottom 0.406: IC9.9 68.58,41.91 73.66,46.99 78.74,46.99 SV4.10
N4_4
  Bottom 0.406: IC9.13 68.58,52.07 69.85,50.8 SV4.7
N4_5
  Bottom 0.406: IC9.14 68.58,54.61 71.12,52.07 78.74,52.07 SV4.6
N4_6
  Bottom 0.406: IC9.11 68.58,46.99 71.12,49.53 78.74,49.53 SV4.8
N4_7
  Bottom 0.406: IC9.10 68.58,44.45 72.39,48.26 SV4.9
N4_8
  Bottom 0.406: IC9.1 60.96,59.69 64.77,63.5 69.85,63.5 76.2,57.15 78.74,57.15 SV4.2
N4_9
  Bottom 0.406: IC9.2 60.96,57.15 66.04,62.23 68.58,62.23 74.93,55.88 SV4.3
N5_0
  Bottom 0.406: IC10.16 21.59,68.58 16.51,73.66 11.43,73.66 SV5.4
N5_1
  Bottom 0.406: IC10.15 21.59,71.12 17.78,74.93 SV5.5
N5_2
  Bottom 0.406: IC10.8 29.21,86.36 26.67,88.9 21.59,88.9 15.24,82.55 SV5.11
N5_3
  Bottom 0.406: IC10.9 21.59,86.36 16.51,81.28 11.43,81.28 SV5.10
N5_4
  Bottom 0.406: IC10.13 21.59,76.2 20.32,77.47 SV5.7
N5_5
  Bottom 0.406: IC10.14 21.59,73.66 19.05,76.2 11.43,76.2 SV5.6
N5_6
  Bottom 0.406: IC10.11 21.59,81.28 19.05,78.74 11.43,78.74 SV5.8
N5_7
  Bottom 0.406: IC10.10 21.59,83.82 17.78,80.01 SV5.9
N5_8
  Bottom 0.406: IC10.1 29.21,68.58 25.4,64.77 20.32,64.77 13.97,71.12 11.43,71.12 SV5.2
N5_9
  Bottom 0.406: IC10.2 29.21,71.12 24.13,66.04 21.59,66.04 15.24,72.39 SV5.3
N6_0
  Bottom 0.406: IC11.16 68.58,86.36 73.66,81.28 78.74,81.28 SV6.4
N6_1
  Bottom 0.406: IC11.15 68.58,83.82 72.39,80.01 SV6.5
N6_2
  Bottom 0.406: IC11.8 60.96,68.58 63.5,66.04 68.58,66.04 74.93,72.39 SV6.11
N6_3
  Bottom 0.406: IC11.9 68.58,68.58 73.66,73.66 78.74,73.66 SV6.10
N6_4
  Bottom 0.406: IC11.13 68.58,78.74 69.85,77.47 SV6.7
N6_5
  Bottom 0.406: IC11.14 68.58,81.28 71.12,78.74 78.74,78.74 SV6.6
N6_6
  Bottom 0.406: IC11.11 68.58,73.66 71.12,76.2 78.74,76.2 SV6.8
N6_7
  Bottom 0.406: IC11.10 68.58,71.12 72.39,74.93 SV6.9
N6_8
  Bottom 0.406: IC11.1 60.96,86.36 64.77,90.17 69.85,90.17 76.2,83.82 78.74,83.82 SV6.2
N6_9
  Bottom 0.406: IC11.2 60.96,83.82 66.04,88.9 68.58,88.9 74.93,82.55 SV6.3
N$1
  Bottom 0.305: IC1.9 45.85,123.19 Q1.2 47.12,121.92 C1.2
  pour Bottom (no thermals): 40.01,123.19 52.7,123.19 53.34,122.56 53.34,121.92 46.35,121.92 45.72,122.56 40.64,122.56
N$2
  Bottom 0.305: IC1.10 45.85,125.73 Q1.1 53.21,126.87 C2.2
  pour Bottom (no thermals): 40.64,126.36 45.72,126.36 46.35,127 53.34,127 53.34,126.36 52.7,125.73 40.01,125.73
N$3
  Bottom 0.61: IC3.9 54.61,15.24 57.15,17.78 IC7.7
N$4
  Bottom 0.61: IC3.10 54.61,17.78 57.15,20.32 IC7.6
N$5
  Bottom 0.61: IC3.11 50.8,20.32 55.88,25.4 IC7.4
N$6
  Bottom 0.61: IC3.12 50.8,22.86 55.88,27.94 IC7.3
N$7
  Bottom 0.61: IC3.4 40.64,25.4 35.56,30.48 IC6.7
N$8
  Bottom 0.61: IC6.6 35.56,27.94 40.64,22.86 IC3.5
N$9
  Bottom 0.61: IC3.6 38.1,20.32 35.56,22.86 IC6.4
N$10
  Bottom 0.61: IC3.7 38.1,17.78 35.56,20.32 IC6.3
N$11
  Bottom 0.61: IC4.4 40.64,52.07 35.56,57.15 IC8.7
N$12
  Bottom 0.61: IC8.6 35.56,54.61 40.64,49.53 IC4.5
N$13
  Bottom 0.61: IC4.6 34.29,46.99 31.75,49.53 IC8.4
N$14
  Bottom 0.61: IC4.7 34.29,44.45 31.75,46.99 IC8.3
N$15
  Bottom 0.61: IC9.7 57.15,44.45 54.61,41.91 IC4.9
N$16
  Bottom 0.61: IC4.10 54.61,44.45 57.15,46.99 IC9.6
N$17
  Bottom 0.813: R6.1 3.81,41.91 5.08,40.64 11.43,40.64 12.7,41.91 SV3.1
N$18
  Bottom 0.61: IC11.6 57.15,73.66 54.61,71.12 IC5.10
N$19
  Bottom 0.61: IC5.4 40.64,78.74 35.56,83.82 IC10.7
N$20
  Bottom 0.61: IC5.5 40.64,76.2 35.56,81.28 IC10.6
N$21
  Bottom 0.61: IC5.6 34.92,73.66 32.38,76.2 IC10.4
N$22
  Bottom 0.61: IC5.7 34.92,71.12 32.38,73.66 IC10.3
N$23
  Bottom 0.61: IC11.7 57.78,71.12 55.24,68.58 IC5.9
N$24
  Bottom 0.813: R4.1 3.81,15.24 5.08,13.97 11.43,13.97 12.7,15.24 SV1.1
N$25
  Bottom 0.813: R5.1 86.36,33.02 85.09,34.29 78.74,34.29 77.47,33.02 SV2.1
N$26
  Bottom 0.813: R7.1 86.36,59.69 85.09,60.96 78.74,60.96 77.47,59.69 SV4.1
N$27  (via drill 0.8 pad 1.27)
  Top 0.305: v46.99,78.74 v46.99,83.82 | v46.99,52.07 v46.99,57.15
  Bottom 0.305: 36.83,97.79 R11.1
  Bottom 0.406: v46.99,78.74 v46.99,57.15 IC4.15 | v46.99,52.07 46.99,30.48 IC3.15 | IC5.15 v46.99,83.82 46.99,87.63 36.83,97.79
  Bottom 0.813: U$1.5 29.21,107.95 31.75,105.41 IC1.27 34.92,105.41 35.56,104.78 35.56,98.42
  pour Bottom (no thermals): 33.02,97.79 35.56,100.33 35.56,99.06 36.83,97.79
  pour Bottom (no thermals): 48.26,83.82 46.99,85.09 46.99,83.82
  pour Bottom (no thermals): 48.26,57.15 46.99,58.42 46.99,57.15
  pour Bottom (no thermals): 48.26,30.48 46.99,31.75 46.99,30.48
N$28
  Bottom 0.305: 31.11,102.87 IC1.28
  Bottom 0.406: 45.72,54.61 45.72,27.94 IC3.14 | 45.72,54.61 45.72,81.28 | 45.72,81.28 IC5.14 | 45.72,54.61 IC4.14 | 45.72,81.28 45.72,86.36 38.1,93.98 R12.1
  Bottom 0.813: R12.1 31.11,95.89 31.11,102.87 28.57,105.41 25.4,105.41 24.13,106.68 U$1.6
  pour Bottom (no thermals): 31.11,99.06 33.02,100.97 33.02,102.87 31.11,102.87
  pour Bottom (no thermals): 46.99,81.28 45.72,82.55 45.72,80.01
  pour Bottom (no thermals): 46.99,54.61 45.72,55.88 45.72,53.34
  pour Bottom (no thermals): 46.99,27.94 45.72,29.21 45.72,27.94
N$29
  Bottom 0.813: R8.1 3.81,68.58 5.08,67.31 11.43,67.31 12.7,68.58 SV5.1
N$30
  Bottom 0.305: X9.1 48.26,130.81 R2.1 44.45,133.35 IC1.13
  pour Bottom (no thermals): 52.07,134.62 43.18,134.62 41.91,133.35 43.81,133.35 46.35,130.81 49.53,130.81 52.07,133.35
N$31
  Bottom 0.61: 52.07,128.91 53.98,130.81 R3.1 57.15,131.44 60.33,134.62 X10.1
  Bottom 1.016: 52.07,128.91 45.09,128.91 43.18,130.81 IC1.12
  pour Bottom (no thermals): 62.23,134.62 57.15,134.62 51.44,128.91 54.61,128.91 57.78,132.08 59.69,132.08
N$32
  Bottom 0.305: 88.9,74.93 88.9,93.98 85.09,97.79 F1.2 | 88.9,74.93 R9.2 | 88.9,48.26 R7.2 | 88.9,48.26 88.9,74.93 | 88.9,21.59 R5.2 | 88.9,21.59 88.9,48.26 | 1.27,26.67 R4.2 | 1.27,53.34 R6.2 | 1.27,26.67 1.27,53.34 | R8.2 1.27,80.01 1.27,53.34 | 88.9,21.59 88.9,10.79 77.47,10.79 77.47,2.54 11.43,2.54 11.43,10.79 1.27,10.79 1.27,26.67
  pour Bottom (no thermals): 0,10.16 17.78,10.16 18.41,9.53 26.67,9.53 27.3,10.16 90.17,10.16 90.17,0 0,0
  pour Bottom (no thermals): 71.12,10.16 73.03,12.06 81.28,12.06 86.36,17.14 86.36,26.67 88.27,28.57 88.27,35.56 86.36,37.47 86.36,53.34 88.27,55.24 88.27,62.23 86.36,64.14 86.36,80.01 88.27,81.92 88.27,88.27 81.28,95.89 81.28,99.69 81.92,100.33 88.9,100.33 90.17,99.06 90.17,1.27 80.01,1.27
  pour Bottom (no thermals): 19.05,8.89 16.51,11.43 3.17,11.43 1.91,12.7 1.91,19.68 3.81,21.59 3.81,27.94 1.27,30.48 0,30.48 0,0 17.78,0 19.05,1.27
  pour Bottom (no thermals): 3.81,27.3 3.81,37.47 1.91,39.37 1.91,46.35 3.81,48.26 3.81,64.14 1.91,66.04 1.91,73.03 3.81,74.93 3.81,80.01 0,80.01 0,26.67 3.17,26.67
N$33
  Bottom 0.305: X2.1 10.2,154.98 15.24,160.02 19.05,160.02
  Bottom 0.406: 19.05,160.02 B1.AC1
  pour Bottom (no thermals): 7.62,154.94 13.34,160.66 20.95,160.66 21.59,160.02 21.59,157.48 19.68,157.48 17.78,159.38 15.24,159.38 10.79,154.94 8.26,154.94
N$34
  Bottom 0.305: X1.2 76.16,161.33 77.47,160.02 | 77.47,160.02 D4.A | D5.A 77.47,151.13 74.93,153.67 74.93,157.48 77.47,160.02
  pour Bottom (no thermals): 78.74,151.76 76.83,151.76 75.56,153.03 75.56,156.84 76.83,158.12 78.74,158.12 79.38,158.75 79.38,160.66 78.11,161.93 78.11,165.74 76.83,167 75.56,167 74.93,166.37 74.93,160.02 74.3,159.38 74.3,152.4 75.56,151.13 76.2,150.5 78.74,150.5 79.38,151.13
N$35
  Bottom 0.305: X1.1 71.16,161.33 D4.C D1.A
  pour Bottom (no thermals): 68.58,154.94 69.85,154.94 70.48,155.57 70.48,159.38 71.75,160.66 71.75,166.37 69.22,166.37 68.58,165.74
N$36
  Bottom 0.305: X2.2 7.58,159.98 10.16,162.56 B1.AC2
  Bottom 0.406: B1.AC2 16.51,162.52
  pour Bottom (no thermals): 7.62,160.02 7.62,163.19 8.26,163.83 8.89,164.47 16.51,164.47 17.14,163.83 17.14,162.56 16.51,161.93 11.43,161.93 9.53,160.02
N$37
  Bottom 0.813: R9.1 86.36,86.36 85.09,87.63 78.74,87.63 77.47,86.36 SV6.1
N$38
  Bottom 0.305: 53.52,162.56 F2.1
  Bottom 0.406: B1.+ C5.+ C6.+ C11.1 53.52,162.56
  pour Bottom (no thermals): 21.59,162.56 21.59,164.47 22.86,165.74 26.04,168.91 57.15,168.91 59.05,170.81 62.23,170.81 62.87,170.18 62.87,163.19 60.96,161.29 24.13,161.29 22.86,162.56
N$39
  Bottom 0.305: D1.C 81.28,154.94 82.55,153.67 82.55,148.59 81.28,147.32 D3.C C9.+ C10.+ 78.74,109.22 76.2,106.68
  Bottom 0.406: 76.2,106.68 64.95,106.68 61.05,102.78 | F1.1 61.05,102.78 | C4.1 60.96,102.87 61.05,102.78
  pour Bottom (no thermals): 78.74,154.94 79.38,155.57 83.82,155.57 85.09,154.31 88.9,150.5 88.9,107.95 85.72,104.78 74.93,104.78 67.31,97.16 55.24,97.16 55.24,104.78 60.33,109.86 60.33,114.3 60.96,114.94 63.5,114.94 67.31,111.12 75.56,111.12 77.47,113.03 77.47,146.05 78.74,147.32 81.28,147.32 82.55,148.59 82.55,153.67 81.28,154.94
N$40
  Bottom 0.406: F2.2 60.2,145.8 53.34,151.13 IC2.1
  pour Bottom (no thermals): 46.99,151.76 56.52,151.76 62.87,145.41 58.42,145.41 53.34,150.5 46.99,150.5
N$64
  Bottom 0.61: IC11.4 55.88,78.74 50.8,73.66 IC5.11
N$65
  Bottom 0.61: IC11.3 55.88,81.28 50.8,76.2 IC5.12
N$66
  Bottom 0.61: IC4.11 50.8,46.99 55.88,52.07 IC9.4
N$67
  Bottom 0.61: IC9.3 55.88,54.61 50.8,49.53 IC4.12
N$104  (via drill 0.8 pad 1.27)
  Top 0.305: v36.83,115.57 v36.83,109.22
  Bottom 0.406: IC1.5 39.37,113.03 36.83,110.49 v36.83,109.22 | R10.1 29.21,113.03 30.48,114.3 35.56,114.3 v36.83,115.57
  Bottom 0.61: U$1.7 21.59,109.22 25.4,113.03 R10.1
N$105
  Bottom 1.016: IC1.4 X11.2
N$106  (via drill 0.8 pad 1.27)
  Top 0.305: v43.18,102.87 43.18,139.7 v31.75,139.7
  Bottom 0.305: C3.1 48.26,96.52 45.72,99.06 R1.1 v43.18,102.87 IC1.1
  Bottom 1.27: T1.C 27.3,151.13 31.75,146.69 R13.1 v31.75,139.7
  pour Bottom (no thermals): 41.27,102.87 41.91,103.5 46.35,103.5 47.62,102.23 47.62,99.06 49.53,97.16 50.16,97.16 50.8,96.52 50.16,95.89 48.26,95.89
N$107
  Bottom 1.016: Q2.1 U$1.2
N$108
  Bottom 0.305: U$1.1 17.58,100.33 C8.2
  Bottom 1.016: Q2.2 U$1.1
  pour Bottom (no thermals): 19.05,96.52 19.05,101.6 16.51,104.14 13.97,104.14 13.97,101.6
N$110
  Bottom 0.305: T1.B 22.86,148.59 25.4,146.05 D2.C R15.2 26.67,142.24 25.4,140.97 25.4,132.08 26.67,130.81 R14.1
  pour Bottom (no thermals): 27.94,130.81 25.4,133.35 25.4,139.7 27.94,142.24 27.94,146.69 26.67,147.96 25.4,147.96 22.86,150.5 22.23,149.86 22.23,135.25 26.67,130.81
N$112
  Bottom 0.61: R14.2 15.88,130.81 13.34,133.35 X12.3
N$113
  Bottom 0.406: X12.8 14.5,134.72 16.51,132.72 20.95,132.72 24.77,128.91 31.11,128.91 31.75,128.27 IC1.18
N$114
  Bottom 0.61: R16.2 16.51,135.89 12.9,135.89 X12.4
N$115
  Bottom 1.016: IC1.17 31.75,130.81 R16.1 D7.C
N$116
  Bottom 0.61: R17.2 16.51,123.19 14.61,125.09 12.06,125.09 10.16,127 X12.6 X12.7
N$117
  Bottom 0.305: C7.1 25.4,120.65 R17.1 D6.C 30.48,127 31.75,125.73 IC1.19
  pour Bottom (no thermals): 25.4,119.38 31.11,125.09 32.38,125.09 33.02,125.73 32.38,126.36 31.11,126.36 30.48,127 26.04,127 25.4,126.36